# EAGLE design ft230x (EAGLE 8.2.2)
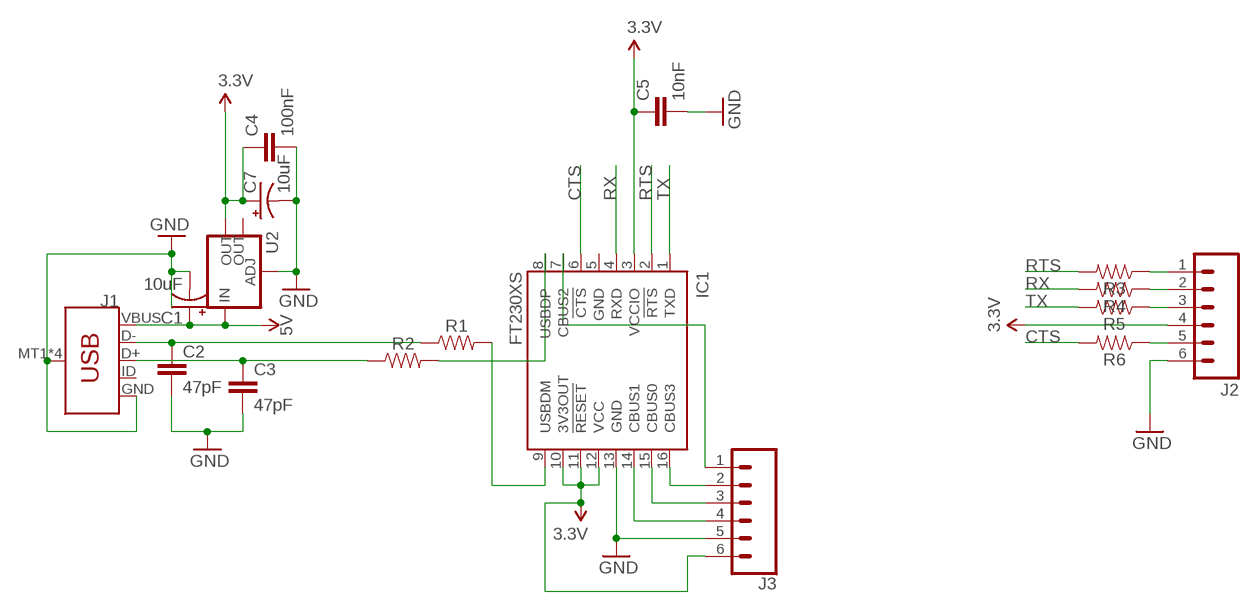
[diagram p0: schematic, sheet 1]

## Parts
C1  10uF  10UF-POLAR-EIA3528-20V-10%(TANT)  [EIA3528]
C2  47pF  CAP1206  [1206@1]
C3  47pF  CAP1206  [1206@1]
C4  100nF  CAP1206  [1206@1]
C5  10nF  1.0UF-1206-50V-10%  [1206]
C7  10uF  10UF-POLAR-EIA3528-20V-10%(TANT)  [EIA3528]
IC1  FT230XS  [SSOP16]
J1  USB_MICRO-B_SMT  [USB-MICROB]
J2  M06SILK_FEMALE_PTH  [1X06@1]
J3  CONN_06SILK_FEMALE_PTH  [1X06]
R1  RESISTOR1206  [1206]
R2  RESISTOR1206  [1206]
R3  RESISTOR0805  [0805]
R4  RESISTOR0805  [0805]
R5  RESISTOR0805  [0805]
R6  RESISTOR0805  [0805]
U2  V_REG_LM1117SOT223  [SOT223]

## Nets
3.3V: C4.1 C5.1 C7.A(+) IC1.3(VCCIO) IC1.10(3V3OUT) IC1.11(!RESET) IC1.12(VCC) J2.4 J3.6 U2.2(OUT)
5V: C1.A(+) J1.VBUS U2.3(IN)
CBUS0: IC1.15(CBUS0) J3.3
CBUS1: IC1.14(CBUS1) J3.4
CBUS2: IC1.7(CBUS2) J3.1
CBUS3: IC1.16(CBUS3) J3.2
CTS: IC1.6(!CTS) R6.2
CTS-: J2.5 R6.1
D+: C3.1 J1.D+ R2.1
D-: C2.1 J1.D- R1.1
GND: C1.C(-) C2.2 C3.2 C4.2 C5.2 C7.C(-) IC1.13(GND) J1.GND J1.MT1(SHIELD) J1.MT2(SHIELD) J1.P$1(SHIELD) J1.P$2(SHIELD) J2.6 J3.5 U2.1(ADJ)
RD+: IC1.8(USBDP) R2.2
RD-: IC1.9(USBDM) R1.2
RTS: IC1.2(!RTS) R3.2
RTS-: J2.1 R3.1
RX: IC1.4(RXD) R4.2
RX-: J2.2 R4.1
TX: IC1.1(TXD) R5.2
TX-: J2.3 R5.1
Unconnected: J1.ID U2.4(OUT)

## Power pins joined to a net without a drawn wire
GND: IC1.5(GND)

## Library data of the parts
C1 C7 = SparkFun-Capacitors:10UF-POLAR: 10.0µF polarized capacitors A capacitor is a passive two-terminal electrical component used to store electrical energy temporarily in an electric field.; PROD_ID: CAP-08063
C2-C4 = SparkFun-Capacitors:CAP: Capacitor Standard 0603 ceramic capacitor, and 0.1" leaded capacitor.
C5 = SparkFun-Capacitors:1.0UF: 1µF ceramic capacitors A capacitor is a passive two-terminal electrical component used to store electrical energy temporarily in an electric field.; PROD_ID: CAP-09822; VALUE: 1.0uF
IC1 = ftdi:FT230X: USB to BASIC UART IC Auto generated by make-symbol-device-package-bsdl.ulp Rev. 43 Source: Data sheet <http://www.ftdichip.com/Support/Documents/DataSheets/ICs/DS_FT230X.pdf>
J1 = SparkFun-Connectors:USB_MICRO-B: USB Type Micro-B Connector Male/female and PTH/SMT variants SparkFun Products: SparkFun microB USB Breakout <https://www.sparkfun.com/products/12035> SparkFun USB microB Plug Breakout <https://www.sparkfun.com/products/10031> SparkFun ESP8266 Thing <https://www.sparkfun.com/products/13231>; PROD_ID: CONN-09505; SF_ID: PRT-08533
J2 = SparkFun-Connectors:M06: Header 6 Standard 6-pin 0.1" header. Use with straight break away headers (SKU : PRT-00116), right angle break away headers (PRT-00553), swiss pins (PRT-00743), machine pins (PRT-00117), and female headers (PRT-00115). Molex polarized connector foot print use with SKU : PRT-08094 with associated crimp pins and housings. NOTES ON THE VARIANTS LOCK and LOCK_LONGPADS... This footprint was designed to help hold the alignment of a through-hole component (i.e. 6-pin header) while soldering it into place. You may notice that each hole has been shifted either up or down by 0.005 of an inch from it's more standard position (which is a perfectly straight line). This slight alteration caused the pins (the squares in the middle) to touch the edges of the holes. Because they are alternating, it causes a "brace" to hold the component in place. 0.005 has proven to be the perfect amount of "off-center" position when using our standard breakaway headers. Although looks a little odd when you look at the bare footprint, once you have a header in there, the alteration is very hard to notice. Also,if you push a header all the way into place, it is covered up entirely on the bottom side. This idea of altering the position of holes to aid alignment will be further integrated into the Sparkfun Library for other footprints. It can help hold any component with 3 or more connection pins.; PROD_ID: CONN-08437
J3 = SparkFun-Connectors:CONN_06: Multi connection point. Often used as Generic Header-pin footprint for 0.1 inch spaced/style header connections On any of the 0.1 inch spaced packages, you can populate with these: Break Away Headers - Straight <https://www.sparkfun.com/products/116> (PRT-00116) Break Away Male Headers - Right Angle <https://www.sparkfun.com/products/553> (PRT-00553) Female Headers <https://www.sparkfun.com/products/115> (PRT-00115) Break Away Headers - Machine Pin <https://www.sparkfun.com/products/117> (PRT-00117) Break Away Female Headers - Swiss Machine Pin <https://www.sparkfun.com/products/743> (PRT-00743) Arduino Stackable Header - 6 Pin <https://www.sparkfun.com/products/9280> (PRT-09280) For SCREWTERMINALS and SPRING TERMINALS visit here: Screw Terimnals on SparkFun.com <https://www.sparkfun.com/search/results?term=Screw+Terminals> (5mm/3.5mm/2.54mm spacing) This device is also useful as a general connection point to wire up your design to another part of your project. Our various solder wires solder well into these plated through hole pads. Hook-Up Wire - Assortment (Stranded, 22 AWG) <https://www.sparkfun.com/products/11375> (PRT-11375) Hook-Up Wire - Assortment (Solid Core, 22 AWG) <https://www.sparkfun.com/products/11367> (PRT-11367) View the entire wire category on our website here <https://www.sparkfun.com/categories/141>; PROD_ID: CONN-08437
R1-R6 = SparkFun-Resistors:RESISTOR: Generic Resistor Package
U2 = SparkFun-IC-Power:V_REG_LM1117: Voltage Regulator LM1117 Standard adjustable voltage regulator but in SMD form. Spark Fun Electronics SKU : COM-00595; PROD_ID: VREG-08170

## Board
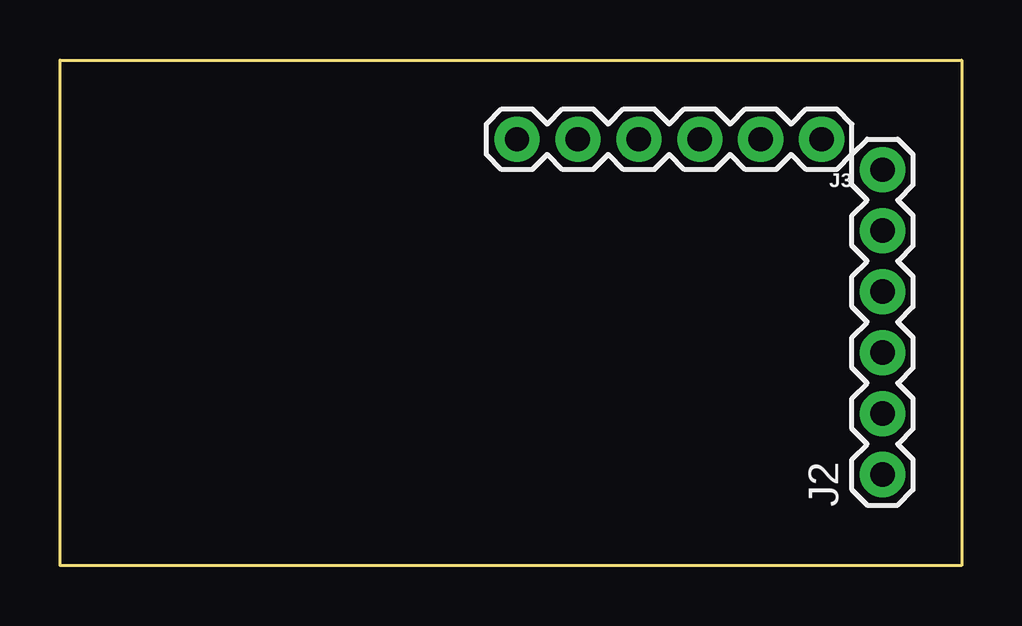
[diagram p1: board, top side]
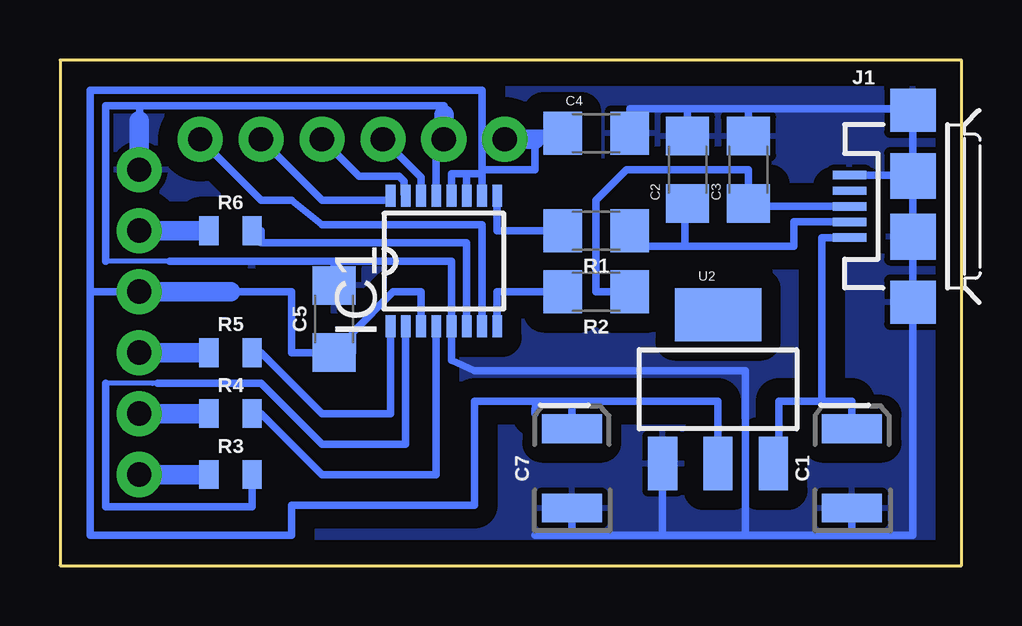
[diagram p2: board, bottom side, seen from below]

Size 37.59 x 21.07 mm. Coordinates in mm from the lower left corner, seen from the top.
Outline: 0,21.07 37.59,21.07 37.59,0 0,0 0,21.07
Copper layers (1*16): Top 0.035mm / dielectric 1.5mm / Bottom 0.035mm
Design rules "default": minimum track width 10mil, minimum drill 24mil, track to track 8mil, track to pad 8mil, pad to pad 8mil, via to via 8mil, smd to smd 8mil, copper to edge 40mil, drill to drill 8mil, minimum pad ring 10mil, minimum via ring 8mil, stop-mask expansion 4mil, vias tented up to drill 0mil, thermal gap 10mil

### Footprints (pad centres in the part's own frame; a part is rotated, then mirrored left to right if it is on the bottom)
EIA3528 = smd 1.2 x 2.5: A 1.65,0; C -1.65,0
1206@1 = smd 1.6 x 1.8: 1 -1.4,0; 2 1.4,0
1206 = smd 1.6 x 1.8: 1 -1.4,0; 2 1.4,0
SSOP16 = smd 0.914 x 0.406: 1 -2.718,2.223; 2 -2.718,1.587; 3 -2.718,0.953; 4 -2.718,0.318; 5 -2.718,-0.318; 6 -2.718,-0.953; 7 -2.718,-1.587; 8 -2.718,-2.223; 9 2.718,-2.223; 10 2.718,-1.587; 11 2.718,-0.953; 12 2.718,-0.318; 13 2.718,0.318; 14 2.718,0.953; 15 2.718,1.587; 16 2.718,2.223
USB-MICROB = smd 1.4 x 0.35: D+ -2.65,0; D- -2.65,-0.65; GND -2.65,1.3; ID -2.65,0.65; VBUS -2.65,-1.3 | smd 1.9 x 1.8: MT1 0,-4; MT2 0,4 | smd 1.9 x 1.9: P$1 0,-1.27; P$2 0,1.27
1X06@1 = drill 1.016 pad 1.88: 1 0,0; 2 2.54,0; 3 5.08,0; 4 7.62,0; 5 10.16,0; 6 12.7,0
1X06 = drill 1.016 pad 1.88: 1 0,0; 2 2.54,0; 3 5.08,0; 4 7.62,0; 5 10.16,0; 6 12.7,0
0805 = smd 0.8 x 1.2: 1 -0.9,0; 2 0.9,0
SOT223 = smd 1.219 x 2.235: 1 -2.311,-3.099; 2 0,-3.099; 3 2.311,-3.099 | smd 3.6 x 2.2: 4 0,3.099

### Placement (x,y rotation side)
C1  4.57,4.05 90 bottom
C2  11.43,16.5 90 bottom
C3  8.89,16.5 90 bottom
C4  15.24,18.02 0 bottom
C5  26.16,10.28 90 bottom
C7  16.26,4.05 90 bottom
IC1  21.59,12.69 90 bottom
J1  2.03,14.98 0 bottom
J2  34.29,3.8 90 top
J3  31.75,17.77 180 top
R1  15.24,13.96 180 bottom
R2  15.24,11.42 180 bottom
R3  30.48,3.8 0 bottom
R4  30.48,6.34 0 bottom
R5  30.48,8.88 0 bottom
R6  30.48,13.96 0 bottom
U2  10.16,7.36 0 bottom

### Tracks (layer width: path | path; a pad name or v marks a point on that pad's centre or on a via)
3.3V
  Bottom 0.305: J2.4 36.32,11.42 | IC1.10 20,16.32 | 20.64,16.32 IC1.11 | 20.64,16.32 20,16.32 | IC1.12 21.27,16.32 20.64,16.32 | 20,16.32 20,16.5 | 20,16.5 20,19.8 36.32,19.8 36.32,11.42 | 20,16.5 17.78,16.5 17.78,17.77 17.78,18.02 C4.1 | 36.32,11.42 36.32,1.26 27.94,1.26 27.94,2.53 20.32,2.53 20.32,6.85 17.77,6.85 | 30.48,11.42 27.94,11.42 27.94,8.88 C5.1 25.4,8.88 25.4,9.72 23.7,11.42 22.54,11.42 IC1.3 | U2.2 10.16,6.85 16.18,6.85 | 16.18,6.85 17.77,6.85 | 17.78,6.34 17.77,6.85 | C7.A 16.26,6.85 16.18,6.85
  Bottom 0.813: C4.1 16.64,17.77 | 17.78,17.77 J3.6 | J2.4 30.48,11.42
5V
  Bottom 0.305: 5.36,13.68 J1.VBUS 5.84,13.68 5.84,6.85 | 5.84,6.85 7.62,6.85 7.62,4.26 U2.3 | C1.A 4.57,6.85 5.84,6.85
CBUS0
  Bottom 0.305: IC1.15 23.25,15.48 23.25,16.01 23.46,16.22 25.12,16.22 J3.3
CBUS1
  Bottom 0.305: IC1.14 22.54,16.18 J3.4
CBUS2
  Bottom 0.305: IC1.7 20,14.21 26.67,14.21 27.94,15.23 29.21,15.23 J3.1
CBUS3
  Bottom 0.305: IC1.16 23.81,15.23 26.67,15.23 J3.2
CTS
  Bottom 0.305: IC1.6 20.64,13.45 29.21,13.45 29.21,13.96 R6.2
CTS-
  Bottom 0.813: R6.1 J2.5
D+
  Bottom 0.305: 8.9,15.1 C3.1 | 8.57,14.78 8.51,14.72 | 8.57,14.78 C3.1 | J1.D+ 8.57,14.98 8.57,14.78 | C3.1 8.89,16.5 13.97,16.5 15.24,15.23 15.24,11.42 R2.1
D-
  Bottom 0.305: 11.54,13.31 13.84,13.31 R1.1 | C2.1 11.54,15.1 11.54,13.31 | 11.54,13.31 7,13.31 7,14.33 J1.D-
GND
  Bottom 0.203: 33.02,12.69 35.69,12.69
  Bottom 0.305: U2.1 12.54,4.45 12.7,4.45 | 34.26,19.17 35.69,19.17 35.69,12.69 | 34.26,19.17 21.59,19.17 21.59,18.79 | IC1.13 21.91,17.77 J3.5 | C4.2 13.84,19.04 11.43,19.04 | 8.89,19.04 11.43,19.04 | 8.89,19.04 2.35,19.04 2.29,18.98 J1.MT2 J1.P$2 | C2.2 11.43,19.04 | C3.2 8.89,19.04 | 26.19,12.69 21.27,12.69 IC1.5 21.27,8.56 20.32,8.12 9.02,8.12 9.02,1.26 | 26.19,12.69 33.02,12.69 | 12.7,4.51 U2.1 | J1.P$2 J1.P$1 2.04,13.71 2.04,10.98 | 2.03,16.28 J1.P$2 | 1.27,10.98 J1.MT1 | J1.MT1 2.04,10.98 | 2.04,10.98 2.04,10.71 | C5.2 26.16,12.66 26.19,12.69 | J1.GND 2.06,16.28 J1.P$2 | 34.29,18.53 34.26,19.17 | 16.34,1.26 12.47,1.26 | 16.34,1.26 17.78,1.26 | J1.MT1 2.03,1.26 4.57,1.26 | 9.02,1.26 4.57,1.26 | 9.02,1.26 12.47,1.26 | C1.C 4.57,1.26 | U2.1 12.47,1.26 | C7.C 16.26,1.26 16.34,1.26
  Bottom 0.813: J2.6 34.29,18.53 | J3.5 21.59,18.79
  pour Bottom (isolate 0.813): 0,21.58 38.1,21.58 38.1,-0.01 0,-0.01
RD+
  Bottom 0.305: R2.2 19.37,11.42 IC1.8
RD-
  Bottom 0.305: R1.2 19.37,13.96 IC1.9
RTS
  Bottom 0.203: 33.53,7.61 33.73,7.59 35.69,7.59
  Bottom 0.305: 35.69,7.59 35.69,2.45 29.58,2.45 R3.2 29.58,3.68 | IC1.2 23.18,5.07 26.67,5.07 29.21,7.61 33.53,7.61
RTS-
  Bottom 0.813: R3.1 J2.1
RX
  Bottom 0.305: IC1.4 21.91,3.8 26.67,3.8 29.21,6.34 R4.2
RX-
  Bottom 0.813: R4.1 J2.2
TX
  Bottom 0.305: IC1.1 23.81,6.34 26.67,6.34 29.21,8.88 R5.2
TX-
  Bottom 0.813: R5.1 J2.3

### Text on the board
tDocu: GND | V G 1 0 3 2 | V G 1 0 3 2 | USB-Serial / FT230X breakout | CTS / 3.3V / TX / RX / RTS